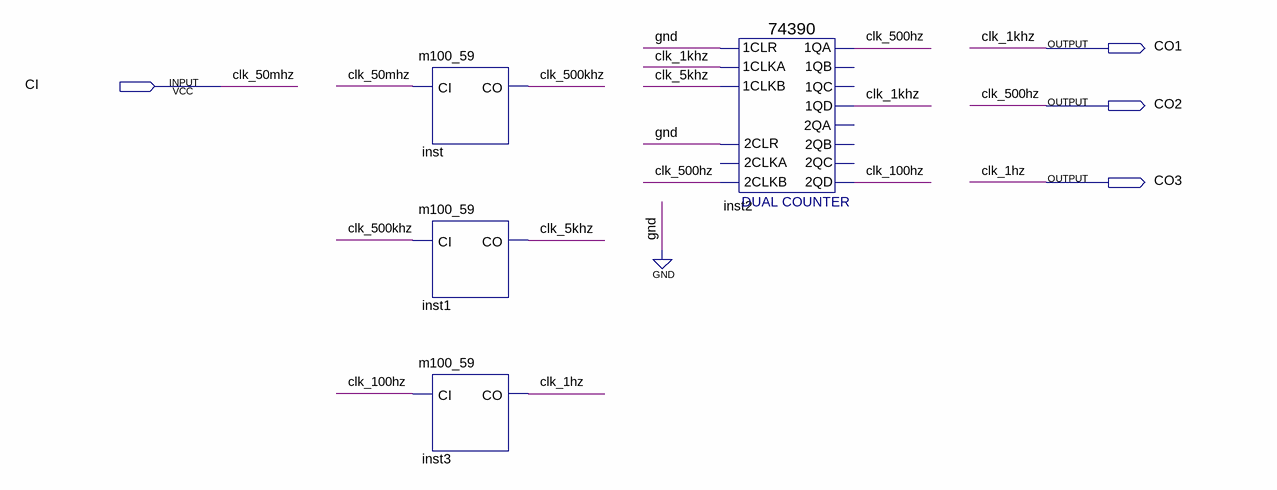
[diagram p0: schematic sheet]
// Quartus schematic fre_div_59.bdf as structural Verilog: 4 symbols, 4 pins
module fre_div_59 (
  input  CI,
  output CO1,
  output CO2,
  output CO3
);

  wire clk_5khz, clk_100hz, clk_500khz;

  m100_59 inst (.CI(CI), .CO(clk_500khz));
  m100_59 inst1 (.CI(clk_500khz), .CO(clk_5khz));
  m100_59 inst3 (.CI(clk_100hz), .CO(CO3));
  \74390  inst2 (
    .\2CLR (1'b0), .\2CLKB (CO2), .\1CLR (1'b0), .\1CLKA (CO1), .\1CLKB (clk_5khz), .\1QA (CO2), .\1QD (CO1),
    .\2QD (clk_100hz));  // open: 2CLKA, 1QB, 1QC, 2QA, 2QB, 2QC

  // Other names for the same wires on the sheet: clk_1hz = CO3; clk_1khz = CO1; clk_50mhz = CI; clk_500hz = CO2
endmodule
